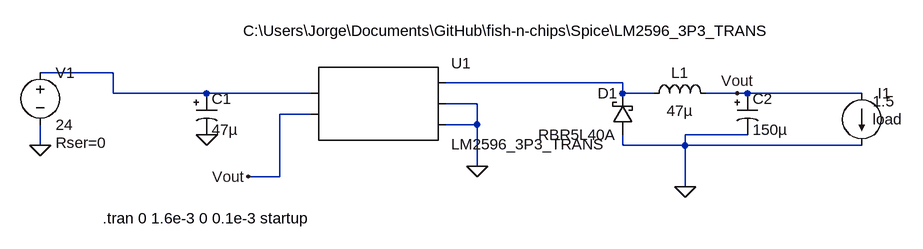
[diagram p0: schematic LM2596-3V3.asc]
LM2596-3V3.asc, the LTspice schematic file:
Version 4
SHEET 1 1020 680
WIRE -208 112 -320 112
WIRE 576 128 304 128
WIRE -208 144 -208 112
WIRE -64 144 -208 144
WIRE 96 144 -64 144
WIRE 576 144 576 128
WIRE 624 144 576 144
WIRE 752 144 704 144
WIRE 768 144 752 144
WIRE 944 144 768 144
WIRE 352 160 304 160
WIRE 96 176 48 176
WIRE 352 192 352 160
WIRE 352 192 304 192
WIRE 768 208 672 208
WIRE -320 224 -320 192
WIRE 576 224 576 208
WIRE 672 224 672 208
WIRE 672 224 576 224
WIRE 944 224 672 224
WIRE 352 256 352 192
WIRE 48 272 48 176
WIRE 48 272 0 272
WIRE 672 288 672 224
FLAG 672 288 0
FLAG -64 208 0
FLAG -320 224 0
FLAG 352 256 0
FLAG 752 144 Vout
FLAG 0 272 Vout
SYMBOL voltage -320 96 R0
WINDOW 123 0 0 Left 2
WINDOW 39 24 124 Left 2
SYMATTR SpiceLine Rser=0
SYMATTR InstName V1
SYMATTR Value 24
SYMBOL polcap -80 144 R0
WINDOW 3 24 56 Left 2
SYMATTR Value 47µ
SYMATTR InstName C1
SYMATTR Description Capacitor
SYMATTR Type cap
SYMATTR SpiceLine V=50 Irms=1.85 Rser=0.05 Lser=0
SYMBOL polcap 752 144 R0
WINDOW 3 24 56 Left 2
SYMATTR Value 150µ
SYMATTR InstName C2
SYMATTR Description Capacitor
SYMATTR Type cap
SYMATTR SpiceLine V=10 Irms=1.73205 Rser=0.055 Lser=0 mfg="KEMET" pn="T520C157M010ATE055" type="Tantalum"
SYMBOL schottky 592 208 R180
WINDOW 0 24 64 Left 2
WINDOW 3 26 0 Left 2
SYMATTR InstName D1
SYMATTR Value RBR5L40A
SYMATTR Description Diode
SYMATTR Type diode
SYMBOL ind 608 160 R270
WINDOW 0 32 56 VTop 2
WINDOW 3 5 56 VBottom 2
SYMATTR InstName L1
SYMATTR Value 47µ
SYMATTR SpiceLine Ipk=5.28 Rser=0.0719 Rpar=0 Cpar=0
SYMBOL load2 944 144 R0
WINDOW 3 17 12 Left 2
WINDOW 123 0 0 Left 2
WINDOW 39 17 40 Left 2
SYMATTR Value 1.5
SYMATTR SpiceLine load
SYMATTR InstName I1
SYMBOL AutoGenerated\\LM2596_3P3_TRANS 192 160 R0
SYMATTR InstName U1
TEXT -224 336 Left 2 !.tran 0 1.6e-3 0 0.1e-3 startup
TEXT -8 48 Left 2 !C:\\Users\\Jorge\\Documents\\GitHub\\fish-n-chips\\Spice\\LM2596_3P3_TRANS

The netlist it stands for:
* LM2596-3V3.asc
V1 N001 0 24 Rser=0
C1 N001 0 47µ V=50 Irms=1.85 Rser=0.05 Lser=0
C2 Vout 0 150µ V=10 Irms=1.73205 Rser=0.055 Lser=0 mfg="KEMET" pn="T520C157M010ATE055" type="Tantalum"
D1 0 N002 RBR5L40A
L1 N002 Vout 47µ Ipk=5.28 Rser=0.0719 Rpar=0 Cpar=0
I1 Vout 0 1.5 load
* U1: LM2596_3P3_TRANS (symbol AutoGenerated\LM2596_3P3_TRANS not available, pins judged from their places): pin1=N001 pin2=Vout pin3=N002 pin4=0 pin5=0
.model D D
.lib standard.dio
.tran 0 1.6e-3 0 0.1e-3 startup
C:\Users\Jorge\Documents\GitHub\fish-n-chips\Spice\LM2596_3P3_TRANS
.backanno
.end